# Altium project rendszerterv.PrjPcb
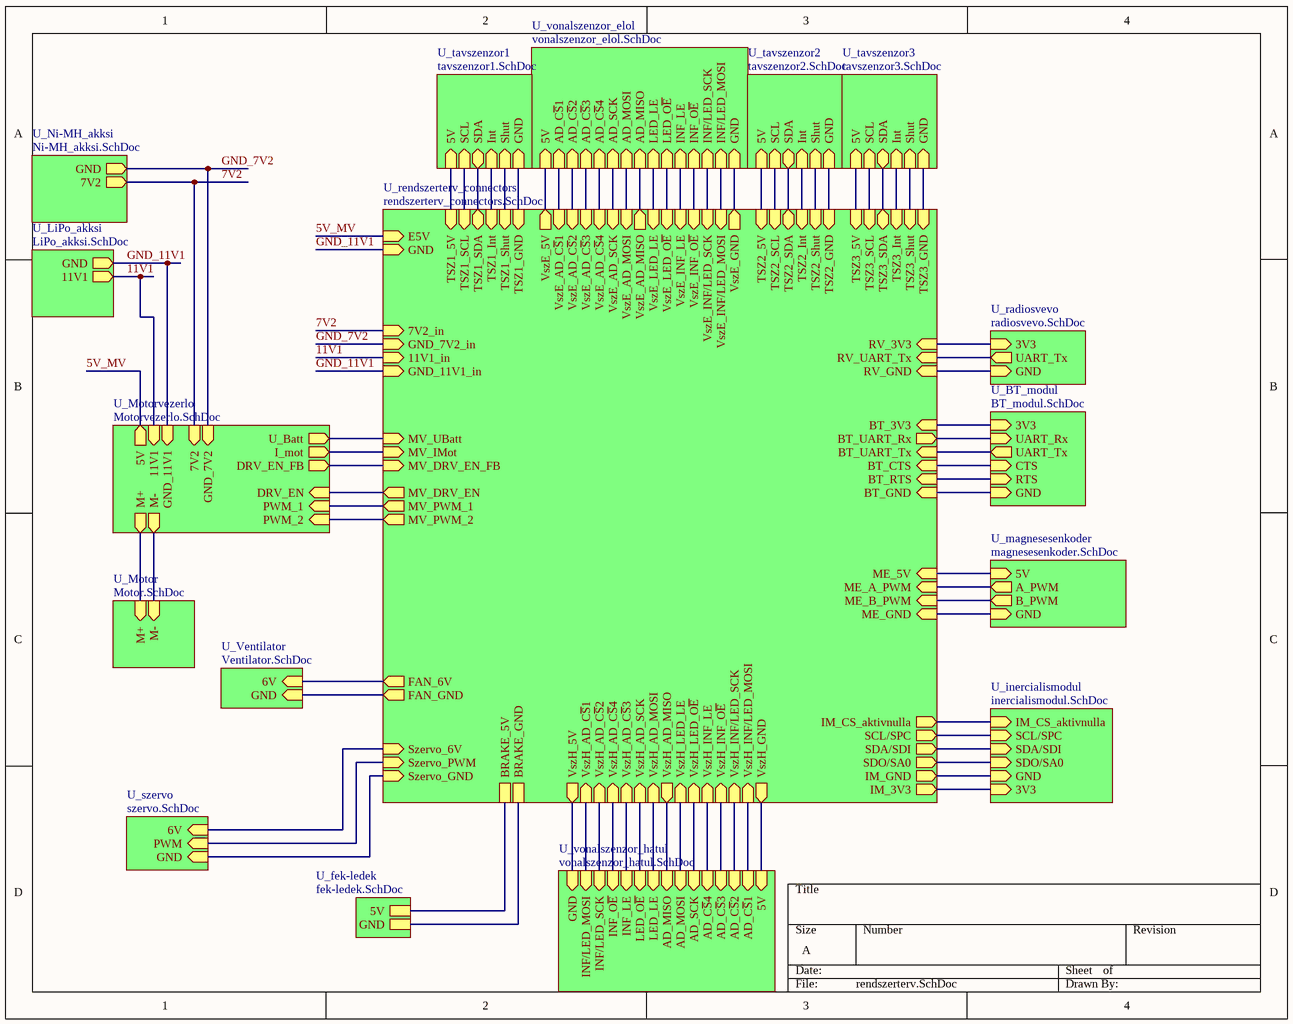
[diagram p0: rendszerterv.SchDoc]
18 sheets, 19 parts. Net scope: hierarchical (ports join the sheet entries above them; power ports are global).
Sheets:
  rendszerterv.SchDoc
    U_vonalszenzor_elol = vonalszenzor_elol.SchDoc
    U_vonalszenzor_hatul = vonalszenzor_hatul.SchDoc
    U_BT_modul = BT_modul.SchDoc
    U_magnesesenkoder = magnesesenkoder.SchDoc
    U_szervo = szervo.SchDoc
    U_radiosvevo = radiosvevo.SchDoc
    U_Ventilator = Ventilator.SchDoc
    U_LiPo_akksi = LiPo_akksi.SchDoc
    U_Motor = Motor.SchDoc
    U_Ni-MH_akksi = Ni-MH_akksi.SchDoc
    U_rendszerterv_connectors = rendszerterv_connectors.SchDoc
    U_tavszenzor1 = tavszenzor1.SchDoc
    U_tavszenzor2 = tavszenzor2.SchDoc
    U_tavszenzor3 = tavszenzor3.SchDoc
    U_Motorvezerlo = Motorvezerlo.SchDoc
    U_fek-ledek = fek-ledek.SchDoc
    U_inercialismodul = inercialismodul.SchDoc

## Sheet rendszerterv.SchDoc
size A

### Sub-sheets
U_BT_modul = BT_modul.SchDoc: UART_Tx (out), UART_Rx (in), 3V3 (in), GND (in), CTS (in), RTS (in)
U_fek-ledek = fek-ledek.SchDoc: 5V, GND
U_inercialismodul = inercialismodul.SchDoc: IM_CS_aktivnulla (in), SCL/SPC (in), SDA/SDI (in), SDO/SA0 (in), GND (in), 3V3 (in)
U_LiPo_akksi = LiPo_akksi.SchDoc: GND (out), 11V1 (out)
U_magnesesenkoder = magnesesenkoder.SchDoc: 5V (in), GND (in), A_PWM (out), B_PWM (out)
U_Motor = Motor.SchDoc: M+ (in), M- (in)
U_Motorvezerlo = Motorvezerlo.SchDoc: 7V2 (in), GND_7V2 (in), 11V1 (in), GND_11V1 (in), 5V (out), U_Batt (out), I_mot (out), DRV_EN_FB (out), DRV_EN (in), PWM_1 (in), PWM_2 (in), M+ (out), M- (out)
U_Ni-MH_akksi = Ni-MH_akksi.SchDoc: 7V2 (out), GND (out)
U_radiosvevo = radiosvevo.SchDoc: 3V3 (in), GND (in), UART_Tx (out)
U_rendszerterv_connectors = rendszerterv_connectors.SchDoc: E5V (in), GND (in), MV_DRV_EN (out), MV_PWM_1 (out), MV_PWM_2 (out), MV_UBatt (in), MV_IMot (in), MV_DRV_EN_FB (in), FAN_6V (out), Szervo_PWM (in), Szervo_GND (in), ME_5V (in), ME_GND (in), ME_A_PWM (in), ME_B_PWM (in), Szervo_6V (in), VszE_5V (out), VszE_AD_C~{S}1 (in), VszE_AD_C~{S}2 (in), VszE_AD_C~{S}3 (in), VszE_AD_C~{S}4 (in), VszE_AD_SCK (in), VszE_AD_MOSI (in), VszE_AD_MISO (out), VszE_LED_LE (in), VszE_LED_O~{E} (in), VszE_INF_LE (in), VszE_INF_O~{E} (in), VszE_INF/LED_SCK (in), VszE_INF/LED_MOSI (in), TSZ1_5V (in), TSZ1_GND (in), TSZ1_SCL (in), TSZ1_SDA (bidir), TSZ1_Int (in), TSZ1_Shut (in), TSZ2_5V (in), TSZ2_GND (in), TSZ2_SCL (in), TSZ2_SDA (bidir), TSZ2_Int (in), TSZ2_Shut (in), TSZ3_5V (in), TSZ3_GND (in), TSZ3_SCL (in), TSZ3_SDA (bidir), TSZ3_Int (in), TSZ3_Shut (in), RV_3V3 (in), RV_GND (in), RV_UART_Tx (in), BT_UART_Tx (in), BT_UART_Rx (out), BT_3V3 (in), BT_GND (in), BT_CTS (in), BT_RTS (in), VszH_INF/LED_SCK (in), VszH_AD_C~{S}1 (in), VszH_AD_SCK (in), VszH_AD_MOSI (in), VszH_INF_O~{E} (in), VszH_INF_LE (in), VszH_AD_MISO (out), VszH_AD_C~{S}3 (in), VszH_AD_C~{S}2 (in), VszH_LED_O~{E} (in), VszH_LED_LE (in), VszH_INF/LED_MOSI (in), VszH_5V (out), VszH_AD_C~{S}4 (in), VszE_GND (out), VszH_GND (out), BRAKE_GND, BRAKE_5V, FAN_GND (out), IM_GND (out), IM_CS_aktivnulla (out), SCL/SPC (out), SDA/SDI (out), SDO/SA0 (out), IM_3V3 (out), 7V2_in (in), GND_7V2_in (in), 11V1_in (in), GND_11V1_in (in)
U_szervo = szervo.SchDoc: 6V (in), GND (in), PWM (in)
U_tavszenzor1 = tavszenzor1.SchDoc: 5V (in), GND (in), SCL (in), SDA (bidir), Int (in), Shut (in)
U_tavszenzor2 = tavszenzor2.SchDoc: 5V (in), GND (in), SCL (in), SDA (bidir), Int (in), Shut (in)
U_tavszenzor3 = tavszenzor3.SchDoc: 5V (in), GND (in), SCL (in), SDA (bidir), Int (in), Shut (in)
U_Ventilator = Ventilator.SchDoc: 6V (in), GND (in)
U_vonalszenzor_elol = vonalszenzor_elol.SchDoc: 5V (in), GND (in), AD_C~{S}1 (in), AD_C~{S}2 (in), AD_C~{S}3 (in), AD_C~{S}4 (in), AD_SCK (in), AD_MOSI (in), AD_MISO (in), LED_LE (in), LED_O~{E} (in), INF_LE (in), INF_O~{E} (in), INF/LED_SCK (in), INF/LED_MOSI (in)
U_vonalszenzor_hatul = vonalszenzor_hatul.SchDoc: 5V (in), GND (in), AD_C~{S}1 (in), AD_C~{S}2 (in), AD_C~{S}3 (in), AD_C~{S}4 (in), AD_SCK (in), AD_MOSI (in), AD_MISO (in), LED_LE (in), LED_O~{E} (in), INF_LE (in), INF_O~{E} (in), INF/LED_SCK (in), INF/LED_MOSI (in)

### Nets
5V_MV: sheet U_rendszerterv_connectors/E5V, sheet U_Motorvezerlo/5V
7V2: sheet U_Ni-MH_akksi/7V2, sheet U_rendszerterv_connectors/7V2_in, sheet U_Motorvezerlo/7V2
11V1: sheet U_LiPo_akksi/11V1, sheet U_rendszerterv_connectors/11V1_in, sheet U_Motorvezerlo/11V1
GND_7V2: sheet U_Ni-MH_akksi/GND, sheet U_rendszerterv_connectors/GND_7V2_in, sheet U_Motorvezerlo/GND_7V2
GND_11V1: sheet U_LiPo_akksi/GND, sheet U_rendszerterv_connectors/GND, sheet U_rendszerterv_connectors/GND_11V1_in, sheet U_Motorvezerlo/GND_11V1
NetD1_1: sheet U_rendszerterv_connectors/BRAKE_5V, sheet U_fek-ledek/5V
NetD1_2: sheet U_rendszerterv_connectors/BRAKE_GND, sheet U_fek-ledek/GND
NetP1_1: sheet U_magnesesenkoder/5V, sheet U_rendszerterv_connectors/ME_5V
NetP1_2: sheet U_magnesesenkoder/B_PWM, sheet U_rendszerterv_connectors/ME_B_PWM
NetP1_3: sheet U_magnesesenkoder/A_PWM, sheet U_rendszerterv_connectors/ME_A_PWM
NetP1_4: sheet U_magnesesenkoder/GND, sheet U_rendszerterv_connectors/ME_GND
NetP2_1: sheet U_szervo/6V, sheet U_rendszerterv_connectors/Szervo_6V
NetP2_2: sheet U_szervo/PWM, sheet U_rendszerterv_connectors/Szervo_PWM
NetP2_3: sheet U_szervo/GND, sheet U_rendszerterv_connectors/Szervo_GND
NetP3_1: sheet U_Ventilator/6V, sheet U_rendszerterv_connectors/FAN_6V
NetP3_2: sheet U_Ventilator/GND, sheet U_rendszerterv_connectors/FAN_GND
NetP4_1: sheet U_rendszerterv_connectors/MV_IMot, sheet U_Motorvezerlo/I_mot
NetP4_2: sheet U_rendszerterv_connectors/MV_UBatt, sheet U_Motorvezerlo/U_Batt
NetP4_3: sheet U_rendszerterv_connectors/MV_DRV_EN_FB, sheet U_Motorvezerlo/DRV_EN_FB
NetP5_1: sheet U_rendszerterv_connectors/MV_DRV_EN, sheet U_Motorvezerlo/DRV_EN
NetP5_2: sheet U_rendszerterv_connectors/MV_PWM_1, sheet U_Motorvezerlo/PWM_1
NetP5_3: sheet U_rendszerterv_connectors/MV_PWM_2, sheet U_Motorvezerlo/PWM_2
NetP7_1: sheet U_vonalszenzor_elol/AD_C~{S}3, sheet U_rendszerterv_connectors/VszE_AD_C~{S}3
NetP7_2: sheet U_vonalszenzor_elol/5V, sheet U_rendszerterv_connectors/VszE_5V
NetP7_3: sheet U_vonalszenzor_elol/AD_C~{S}4, sheet U_rendszerterv_connectors/VszE_AD_C~{S}4
NetP7_5: sheet U_vonalszenzor_elol/AD_MOSI, sheet U_rendszerterv_connectors/VszE_AD_MOSI
NetP7_6: sheet U_vonalszenzor_elol/AD_SCK, sheet U_rendszerterv_connectors/VszE_AD_SCK
NetP7_7: sheet U_vonalszenzor_elol/AD_MISO, sheet U_rendszerterv_connectors/VszE_AD_MISO
NetP7_8: sheet U_vonalszenzor_elol/AD_C~{S}1, sheet U_rendszerterv_connectors/VszE_AD_C~{S}1
NetP7_9: sheet U_vonalszenzor_elol/GND, sheet U_rendszerterv_connectors/VszE_GND
NetP7_10: sheet U_vonalszenzor_elol/AD_C~{S}2, sheet U_rendszerterv_connectors/VszE_AD_C~{S}2
NetP7_13: sheet U_vonalszenzor_elol/LED_LE, sheet U_rendszerterv_connectors/VszE_LED_LE
NetP7_14: sheet U_vonalszenzor_elol/LED_O~{E}, sheet U_rendszerterv_connectors/VszE_LED_O~{E}
NetP7_15: sheet U_vonalszenzor_elol/INF/LED_SCK, sheet U_rendszerterv_connectors/VszE_INF/LED_SCK
NetP7_16: sheet U_vonalszenzor_elol/INF/LED_MOSI, sheet U_rendszerterv_connectors/VszE_INF/LED_MOSI
NetP7_17: sheet U_vonalszenzor_elol/INF_LE, sheet U_rendszerterv_connectors/VszE_INF_LE
NetP7_19: sheet U_vonalszenzor_elol/INF_O~{E}, sheet U_rendszerterv_connectors/VszE_INF_O~{E}
NetP8_1: sheet U_vonalszenzor_hatul/INF_LE, sheet U_rendszerterv_connectors/VszH_AD_C~{S}3
NetP8_2: sheet U_vonalszenzor_hatul/GND, sheet U_rendszerterv_connectors/VszH_5V
NetP8_3: sheet U_vonalszenzor_hatul/INF_O~{E}, sheet U_rendszerterv_connectors/VszH_AD_C~{S}4
NetP8_5: sheet U_vonalszenzor_hatul/LED_LE, sheet U_rendszerterv_connectors/VszH_AD_MOSI
NetP8_6: sheet U_vonalszenzor_hatul/LED_O~{E}, sheet U_rendszerterv_connectors/VszH_AD_SCK
NetP8_7: sheet U_vonalszenzor_hatul/AD_MISO, sheet U_rendszerterv_connectors/VszH_AD_MISO
NetP8_8: sheet U_vonalszenzor_hatul/INF/LED_MOSI, sheet U_rendszerterv_connectors/VszH_AD_C~{S}1
NetP8_9: sheet U_vonalszenzor_hatul/5V, sheet U_rendszerterv_connectors/VszH_GND
NetP8_10: sheet U_vonalszenzor_hatul/INF/LED_SCK, sheet U_rendszerterv_connectors/VszH_AD_C~{S}2
NetP8_13: sheet U_vonalszenzor_hatul/AD_MOSI, sheet U_rendszerterv_connectors/VszH_LED_LE
NetP8_14: sheet U_vonalszenzor_hatul/AD_SCK, sheet U_rendszerterv_connectors/VszH_LED_O~{E}
NetP8_15: sheet U_vonalszenzor_hatul/AD_C~{S}2, sheet U_rendszerterv_connectors/VszH_INF/LED_SCK
NetP8_16: sheet U_vonalszenzor_hatul/AD_C~{S}1, sheet U_rendszerterv_connectors/VszH_INF/LED_MOSI
NetP8_17: sheet U_vonalszenzor_hatul/AD_C~{S}4, sheet U_rendszerterv_connectors/VszH_INF_LE
NetP8_19: sheet U_vonalszenzor_hatul/AD_C~{S}3, sheet U_rendszerterv_connectors/VszH_INF_O~{E}
NetP9_1: sheet U_BT_modul/3V3, sheet U_rendszerterv_connectors/BT_3V3
NetP9_2: sheet U_BT_modul/UART_Tx, sheet U_rendszerterv_connectors/BT_UART_Tx
NetP9_3: sheet U_BT_modul/UART_Rx, sheet U_rendszerterv_connectors/BT_UART_Rx
NetP9_4: sheet U_BT_modul/CTS, sheet U_rendszerterv_connectors/BT_CTS
NetP9_5: sheet U_BT_modul/RTS, sheet U_rendszerterv_connectors/BT_RTS
NetP9_6: sheet U_BT_modul/GND, sheet U_rendszerterv_connectors/BT_GND
NetP10_1: sheet U_radiosvevo/3V3, sheet U_rendszerterv_connectors/RV_3V3
NetP10_2: sheet U_radiosvevo/UART_Tx, sheet U_rendszerterv_connectors/RV_UART_Tx
NetP10_3: sheet U_radiosvevo/GND, sheet U_rendszerterv_connectors/RV_GND
NetP11_1: sheet U_rendszerterv_connectors/TSZ3_5V, sheet U_tavszenzor3/5V
NetP11_2: sheet U_rendszerterv_connectors/TSZ3_SCL, sheet U_tavszenzor3/SCL
NetP11_3: sheet U_rendszerterv_connectors/TSZ3_SDA, sheet U_tavszenzor3/SDA
NetP11_4: sheet U_rendszerterv_connectors/TSZ3_Int, sheet U_tavszenzor3/Int
NetP11_5: sheet U_rendszerterv_connectors/TSZ3_Shut, sheet U_tavszenzor3/Shut
NetP11_6: sheet U_rendszerterv_connectors/TSZ3_GND, sheet U_tavszenzor3/GND
NetP12_1: sheet U_rendszerterv_connectors/TSZ2_5V, sheet U_tavszenzor2/5V
NetP12_2: sheet U_rendszerterv_connectors/TSZ2_SCL, sheet U_tavszenzor2/SCL
NetP12_3: sheet U_rendszerterv_connectors/TSZ2_SDA, sheet U_tavszenzor2/SDA
NetP12_4: sheet U_rendszerterv_connectors/TSZ2_Int, sheet U_tavszenzor2/Int
NetP12_5: sheet U_rendszerterv_connectors/TSZ2_Shut, sheet U_tavszenzor2/Shut
NetP12_6: sheet U_rendszerterv_connectors/TSZ2_GND, sheet U_tavszenzor2/GND
NetP13_1: sheet U_rendszerterv_connectors/TSZ1_5V, sheet U_tavszenzor1/5V
NetP13_2: sheet U_rendszerterv_connectors/TSZ1_SCL, sheet U_tavszenzor1/SCL
NetP13_3: sheet U_rendszerterv_connectors/TSZ1_SDA, sheet U_tavszenzor1/SDA
NetP13_4: sheet U_rendszerterv_connectors/TSZ1_Int, sheet U_tavszenzor1/Int
NetP13_5: sheet U_rendszerterv_connectors/TSZ1_Shut, sheet U_tavszenzor1/Shut
NetP13_6: sheet U_rendszerterv_connectors/TSZ1_GND, sheet U_tavszenzor1/GND
NetP17_1: sheet U_rendszerterv_connectors/IM_3V3, sheet U_inercialismodul/3V3
NetP17_2: sheet U_rendszerterv_connectors/SDO/SA0, sheet U_inercialismodul/SDO/SA0
NetP17_3: sheet U_rendszerterv_connectors/SDA/SDI, sheet U_inercialismodul/SDA/SDI
NetP17_4: sheet U_rendszerterv_connectors/SCL/SPC, sheet U_inercialismodul/SCL/SPC
NetP17_5: sheet U_rendszerterv_connectors/IM_CS_aktivnulla, sheet U_inercialismodul/IM_CS_aktivnulla
NetP17_6: sheet U_rendszerterv_connectors/IM_GND, sheet U_inercialismodul/GND
(unnamed): sheet U_Motor/M+, sheet U_Motorvezerlo/M+
(unnamed): sheet U_Motor/M-, sheet U_Motorvezerlo/M-

## Sheet vonalszenzor_elol.SchDoc
size A
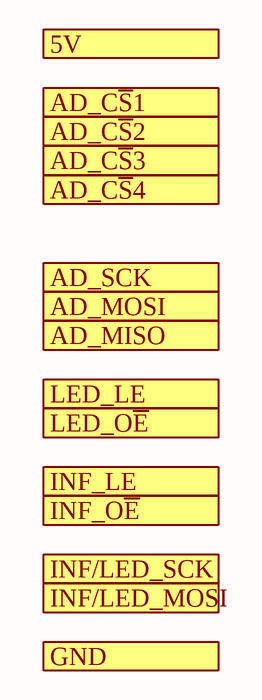
[diagram p1: vonalszenzor_elol.SchDoc]

### Ports
5V (in), AD_C~{S}1 (in), AD_C~{S}2 (in), AD_C~{S}3 (in), AD_C~{S}4 (in), AD_MISO (out), AD_MOSI (in), AD_SCK (in), GND (in), INF/LED_MOSI (in), INF/LED_SCK (in), INF_LE (in), INF_O~{E} (in), LED_LE (in), LED_O~{E} (in)

## Sheet vonalszenzor_hatul.SchDoc
size A
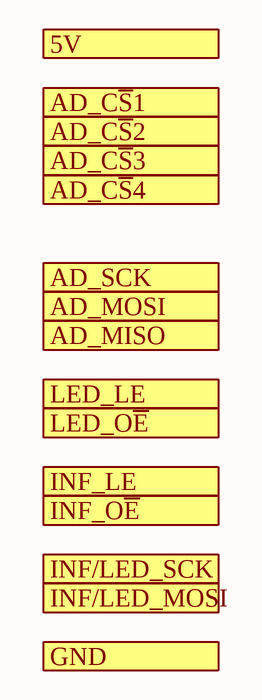
[diagram p2: vonalszenzor_hatul.SchDoc]

### Ports
5V (in), AD_C~{S}1 (in), AD_C~{S}2 (in), AD_C~{S}3 (in), AD_C~{S}4 (in), AD_MISO (out), AD_MOSI (in), AD_SCK (in), GND (in), INF/LED_MOSI (in), INF/LED_SCK (in), INF_LE (in), INF_O~{E} (in), LED_LE (in), LED_O~{E} (in)

## Sheet BT_modul.SchDoc
size A
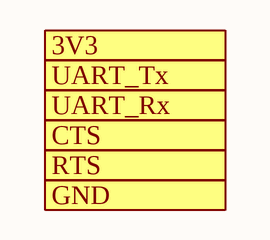
[diagram p3: BT_modul.SchDoc]

### Ports
3V3 (in), CTS (in), GND (in), RTS (in), UART_Rx (in), UART_Tx (out)

## Sheet magnesesenkoder.SchDoc
size A
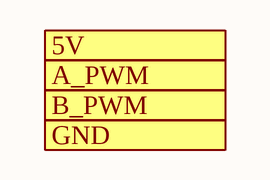
[diagram p4: magnesesenkoder.SchDoc]

### Ports
5V (in), A_PWM (out), B_PWM (out), GND (in)

## Sheet szervo.SchDoc
size A
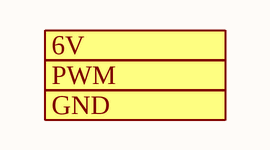
[diagram p5: szervo.SchDoc]

### Ports
6V (in), GND (in), PWM (in)

## Sheet radiosvevo.SchDoc
size A
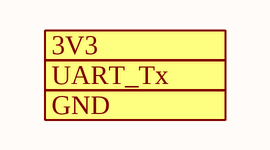
[diagram p6: radiosvevo.SchDoc]

### Ports
3V3 (in), GND (in), UART_Tx (out)

## Sheet Ventilator.SchDoc
size A4
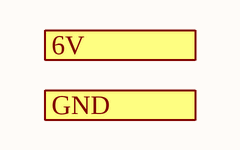
[diagram p7: Ventilator.SchDoc]

### Ports
6V (in), GND (in)

## Sheet LiPo_akksi.SchDoc
size A4
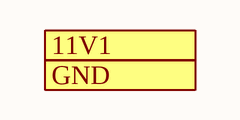
[diagram p8: LiPo_akksi.SchDoc]

### Ports
11V1 (out), GND (out)

## Sheet Motor.SchDoc
size A4
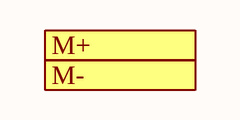
[diagram p9: Motor.SchDoc]

### Ports
M+ (in), M- (in)

## Sheet Ni-MH_akksi.SchDoc
size A4
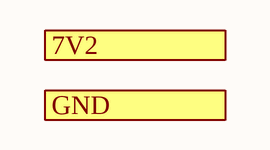
[diagram p10: Ni-MH_akksi.SchDoc]

### Ports
7V2 (out), GND (out)

## Sheet rendszerterv_connectors.SchDoc
size A
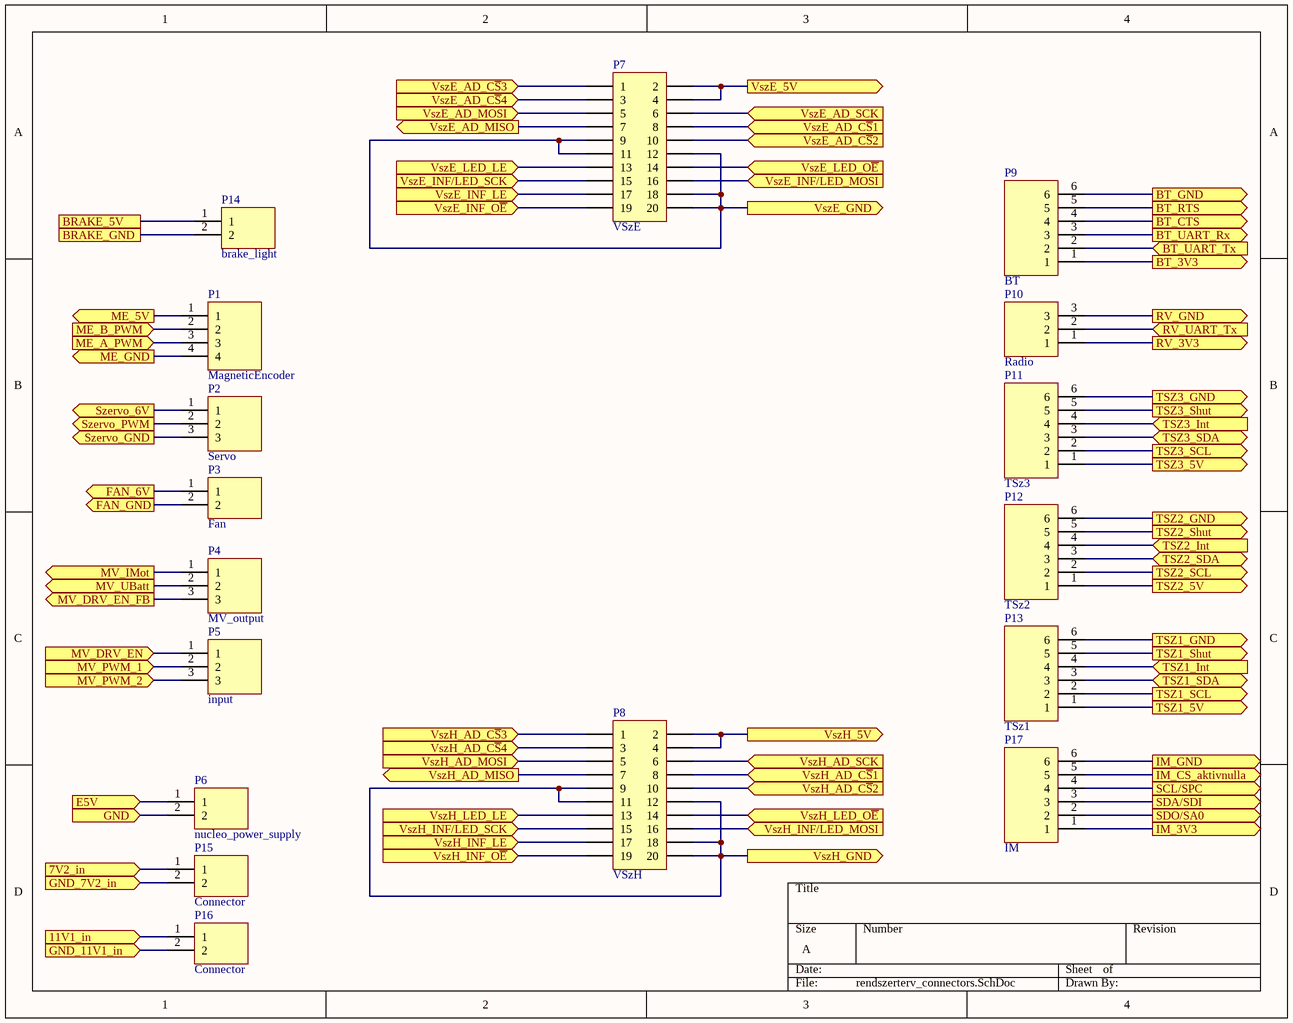
[diagram p11: rendszerterv_connectors.SchDoc]

### Parts
P1  MagneticEncoder  [FP_CONN4_2MM_180]
P2  Servo  [FP_CONN3_TUSKE_254MM]
P3  Fan  [FP_CONN2_TUSKE_254MM]
P4  MV_output  [FP_CONN3_TUSKE_254MM]
P5  input  [FP_CONN3_TUSKE_254MM]
P6  nucleo_power_supply  [FP_CONN2_TAP_254MM]
P7  VSzE  [CONNECTOR-20P]
P8  VSzH  [CONNECTOR-20P]
P9  BT  [FP_CONN6_2MM_180]
P10  Radio  [FP_CONN3_TUSKE_254MM]
P11  TSz3  [FP_CONN6_2MM_180]
P12  TSz2  [FP_CONN6_2MM_180]
P13  TSz1  [FP_CONN6_2MM_180]
P14  brake_light  [FP_CONN2_TAP_254MM]
P15  Connector  [FP_CONN2_TAP_254MM]
P16  Connector  [FP_CONN2_TAP_254MM]
P17  IM  [FP_CONN6_TAP_254MM]

### Ports
7V2_in (in), 11V1_in (in), BRAKE_5V, BRAKE_GND, BT_3V3 (out), BT_CTS (out), BT_GND (out), BT_RTS (out), BT_UART_Rx (out), BT_UART_Tx (in), E5V (in), FAN_6V (out), FAN_GND (out), GND (in), GND_7V2_in (in), GND_11V1_in (in), IM_3V3 (out), IM_CS_aktivnulla (out), IM_GND (out), ME_5V (out), ME_A_PWM (in), ME_B_PWM (in), ME_GND (out), MV_DRV_EN (in), MV_DRV_EN_FB (out), MV_IMot (out), MV_PWM_1 (in), MV_PWM_2 (in), MV_UBatt (out), RV_3V3 (out), RV_GND (out), RV_UART_Tx (in), SCL/SPC (out), SDA/SDI (out), SDO/SA0 (out), Szervo_6V (out), Szervo_GND (out), Szervo_PWM (out), TSZ1_5V (out), TSZ1_GND (out), TSZ1_Int (in), TSZ1_SCL (out), TSZ1_SDA (bidir), TSZ1_Shut (out), TSZ2_5V (out), TSZ2_GND (out), TSZ2_Int (in), TSZ2_SCL (out), TSZ2_SDA (bidir), TSZ2_Shut (out), TSZ3_5V (out), TSZ3_GND (out), TSZ3_Int (in), TSZ3_SCL (out), TSZ3_SDA (bidir), TSZ3_Shut (out), VszE_5V (out), VszE_AD_C~{S}1 (in), VszE_AD_C~{S}2 (in), VszE_AD_C~{S}3 (in), VszE_AD_C~{S}4 (in), VszE_AD_MISO (out), VszE_AD_MOSI (in), VszE_AD_SCK (in), VszE_GND (out), VszE_INF/LED_MOSI (in), VszE_INF/LED_SCK (in), VszE_INF_LE (in), VszE_INF_O~{E} (in), VszE_LED_LE (in), VszE_LED_O~{E} (in), VszH_5V (out), VszH_AD_C~{S}1 (in), VszH_AD_C~{S}2 (in), VszH_AD_C~{S}3 (in), VszH_AD_C~{S}4 (in), VszH_AD_MISO (out), VszH_AD_MOSI (in), VszH_AD_SCK (in), VszH_GND (out), VszH_INF/LED_MOSI (in), VszH_INF/LED_SCK (in), VszH_INF_LE (in), VszH_INF_O~{E} (in), VszH_LED_LE (in), VszH_LED_O~{E} (in)

### Nets
5V_MV: P6.1 ; port E5V
7V2: P15.1 ; port 7V2_in
11V1: P16.1 ; port 11V1_in
GND_7V2: P15.2 ; port GND_7V2_in
GND_11V1: P6.2 P16.2 ; port GND, port GND_11V1_in
NetD1_1: P14.1 ; port BRAKE_5V
NetD1_2: P14.2 ; port BRAKE_GND
NetP1_1: P1.1 ; port ME_5V
NetP1_2: P1.2 ; port ME_B_PWM
NetP1_3: P1.3 ; port ME_A_PWM
NetP1_4: P1.4 ; port ME_GND
NetP2_1: P2.1 ; port Szervo_6V
NetP2_2: P2.2 ; port Szervo_PWM
NetP2_3: P2.3 ; port Szervo_GND
NetP3_1: P3.1 ; port FAN_6V
NetP3_2: P3.2 ; port FAN_GND
NetP4_1: P4.1 ; port MV_IMot
NetP4_2: P4.2 ; port MV_UBatt
NetP4_3: P4.3 ; port MV_DRV_EN_FB
NetP5_1: P5.1 ; port MV_DRV_EN
NetP5_2: P5.2 ; port MV_PWM_1
NetP5_3: P5.3 ; port MV_PWM_2
NetP7_1: P7.1 ; port VszE_AD_C~{S}3
NetP7_2: P7.2 P7.4 ; port VszE_5V
NetP7_3: P7.3 ; port VszE_AD_C~{S}4
NetP7_5: P7.5 ; port VszE_AD_MOSI
NetP7_6: P7.6 ; port VszE_AD_SCK
NetP7_7: P7.7 ; port VszE_AD_MISO
NetP7_8: P7.8 ; port VszE_AD_C~{S}1
NetP7_9: P7.9 P7.11 P7.12 P7.18 P7.20 ; port VszE_GND
NetP7_10: P7.10 ; port VszE_AD_C~{S}2
NetP7_13: P7.13 ; port VszE_LED_LE
NetP7_14: P7.14 ; port VszE_LED_O~{E}
NetP7_15: P7.15 ; port VszE_INF/LED_SCK
NetP7_16: P7.16 ; port VszE_INF/LED_MOSI
NetP7_17: P7.17 ; port VszE_INF_LE
NetP7_19: P7.19 ; port VszE_INF_O~{E}
NetP8_1: P8.1 ; port VszH_AD_C~{S}3
NetP8_2: P8.2 P8.4 ; port VszH_5V
NetP8_3: P8.3 ; port VszH_AD_C~{S}4
NetP8_5: P8.5 ; port VszH_AD_MOSI
NetP8_6: P8.6 ; port VszH_AD_SCK
NetP8_7: P8.7 ; port VszH_AD_MISO
NetP8_8: P8.8 ; port VszH_AD_C~{S}1
NetP8_9: P8.9 P8.11 P8.12 P8.18 P8.20 ; port VszH_GND
NetP8_10: P8.10 ; port VszH_AD_C~{S}2
NetP8_13: P8.13 ; port VszH_LED_LE
NetP8_14: P8.14 ; port VszH_LED_O~{E}
NetP8_15: P8.15 ; port VszH_INF/LED_SCK
NetP8_16: P8.16 ; port VszH_INF/LED_MOSI
NetP8_17: P8.17 ; port VszH_INF_LE
NetP8_19: P8.19 ; port VszH_INF_O~{E}
NetP9_1: P9.1 ; port BT_3V3
NetP9_2: P9.2 ; port BT_UART_Tx
NetP9_3: P9.3 ; port BT_UART_Rx
NetP9_4: P9.4 ; port BT_CTS
NetP9_5: P9.5 ; port BT_RTS
NetP9_6: P9.6 ; port BT_GND
NetP10_1: P10.1 ; port RV_3V3
NetP10_2: P10.2 ; port RV_UART_Tx
NetP10_3: P10.3 ; port RV_GND
NetP11_1: P11.1 ; port TSZ3_5V
NetP11_2: P11.2 ; port TSZ3_SCL
NetP11_3: P11.3 ; port TSZ3_SDA
NetP11_4: P11.4 ; port TSZ3_Int
NetP11_5: P11.5 ; port TSZ3_Shut
NetP11_6: P11.6 ; port TSZ3_GND
NetP12_1: P12.1 ; port TSZ2_5V
NetP12_2: P12.2 ; port TSZ2_SCL
NetP12_3: P12.3 ; port TSZ2_SDA
NetP12_4: P12.4 ; port TSZ2_Int
NetP12_5: P12.5 ; port TSZ2_Shut
NetP12_6: P12.6 ; port TSZ2_GND
NetP13_1: P13.1 ; port TSZ1_5V
NetP13_2: P13.2 ; port TSZ1_SCL
NetP13_3: P13.3 ; port TSZ1_SDA
NetP13_4: P13.4 ; port TSZ1_Int
NetP13_5: P13.5 ; port TSZ1_Shut
NetP13_6: P13.6 ; port TSZ1_GND
NetP17_1: P17.1 ; port IM_3V3
NetP17_2: P17.2 ; port SDO/SA0
NetP17_3: P17.3 ; port SDA/SDI
NetP17_4: P17.4 ; port SCL/SPC
NetP17_5: P17.5 ; port IM_CS_aktivnulla
NetP17_6: P17.6 ; port IM_GND

### Library data of the parts
P1 = Connector_4pin: 4pin Connector
P2 P4 P5 P10 = Connector_3pin: 3pin connector
P3 P6 P14-P16 = Connector_2pin: 2pin connector
P7 P8 = Connector 20: Ribbon cable connector; Reference: *; Supplier: *; Name: *
P9 P11-P13 P17 = Connector_6pin: 6pin connector

## Sheet tavszenzor1.SchDoc
size A
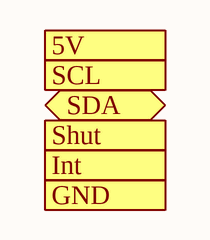
[diagram p12: tavszenzor1.SchDoc]

### Ports
5V (in), GND (in), Int (in), SCL (in), SDA (bidir), Shut (in)

## Sheet tavszenzor2.SchDoc
size A
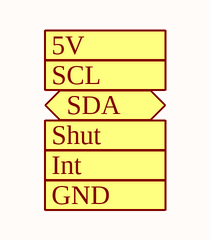
[diagram p13: tavszenzor2.SchDoc]

### Ports
5V (in), GND (in), Int (in), SCL (in), SDA (bidir), Shut (in)

## Sheet tavszenzor3.SchDoc
size A
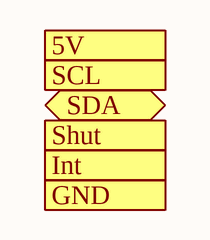
[diagram p14: tavszenzor3.SchDoc]

### Ports
5V (in), GND (in), Int (in), SCL (in), SDA (bidir), Shut (in)

## Sheet Motorvezerlo.SchDoc
size A4
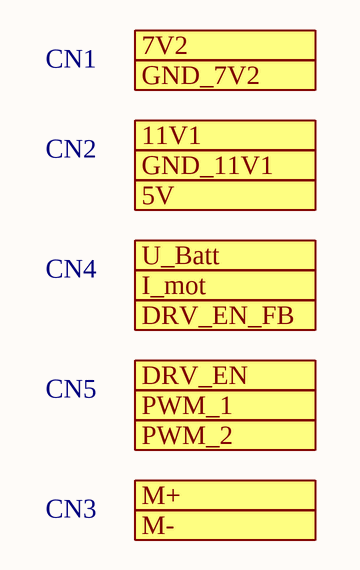
[diagram p15: Motorvezerlo.SchDoc]

### Ports
5V (out), 7V2 (in), 11V1 (in), DRV_EN (in), DRV_EN_FB (out), GND_7V2 (in), GND_11V1 (in), I_mot (out), M+ (out), M- (out), PWM_1 (in), PWM_2 (in), U_Batt (out)

### Notes on the sheet
- CN1
- CN2
- CN4
- CN5
- CN3

## Sheet fek-ledek.SchDoc
size A
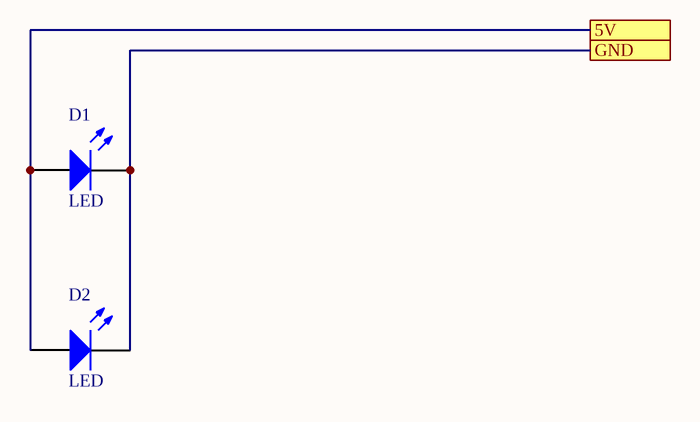
[diagram p16: fek-ledek.SchDoc]

### Parts
D1  LED  [FP_LED_TH_RED]
D2  LED  [FP_LED_TH_RED]

### Ports
5V, GND

### Nets
NetD1_1: D1.1(A) D2.1(A) ; port 5V
NetD1_2: D1.2(K) D2.2(K) ; port GND

### Library data of the parts
D1 D2 = LED: Typical RED GaAs LED; pin to pad: 1>A 2>K

## Sheet inercialismodul.SchDoc
size A
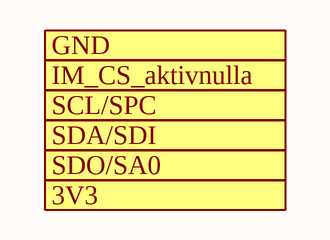
[diagram p17: inercialismodul.SchDoc]

### Ports
3V3 (in), GND (in), IM_CS_aktivnulla (in), SCL/SPC (in), SDA/SDI (in), SDO/SA0 (in)

## Nets that join several sheets
NetD1_1: rendszerterv_connectors (P14.1), fek-ledek (D1.1 D2.1)
NetD1_2: rendszerterv_connectors (P14.2), fek-ledek (D1.2 D2.2)